# EAGLE design emrelabs-PanelDuino-2x8 (EAGLE 8.5.1)

## Sheet 1 of 2
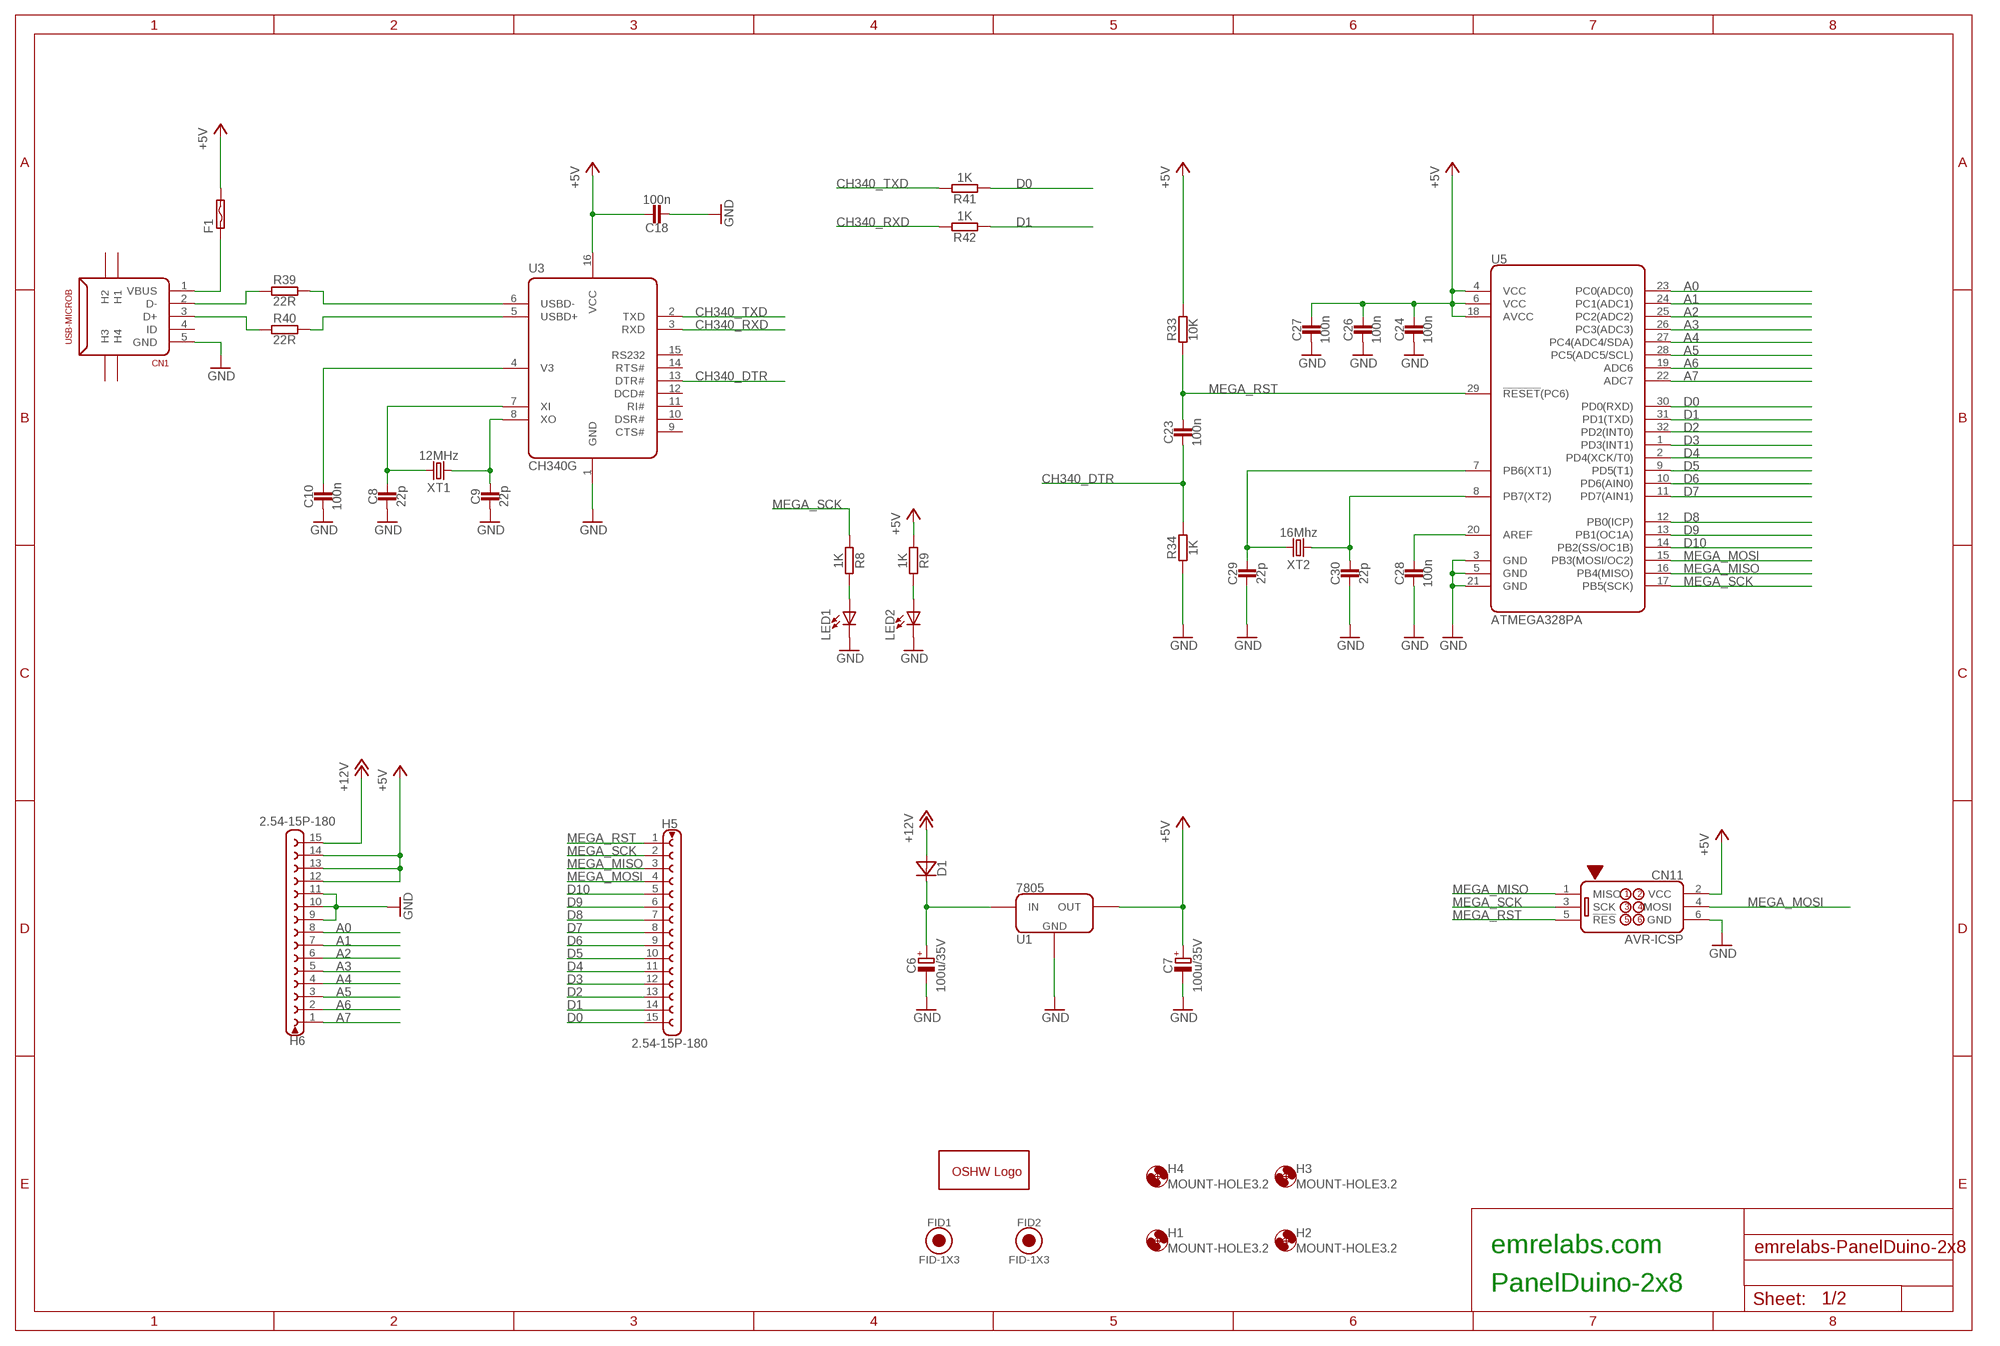
[diagram p0: schematic, sheet 1]

### Parts
C6  100u/35V  C-POL-SIZE-D-100U/35V  [ALU-SIZE-D]
C7  100u/35V  C-POL-SIZE-D-100U/35V  [ALU-SIZE-D]
C8  22p  C1206  [C1206]
C9  22p  C1206  [C1206]
C10  100n  C1206-100N  [C1206]
C18  100n  C1206-100N  [C1206]
C23  100n  C1206-100N  [C1206]
C24  100n  C1206-100N  [C1206]
C26  100n  C1206-100N  [C1206]
C27  100n  C1206-100N  [C1206]
C28  100n  C1206-100N  [C1206]
C29  22p  C1206  [C1206]
C30  22p  C1206  [C1206]
CN1  USB-MICROB  [USB-MICRO-B]
CN11  AVR-ICSP  [AVR-ICSP]
D1  D-DO214AC  [DO214AC]
F1  FUSE-PTC-1206  [F1206]
FID1  FID-1X3  FIDUCIAL1X3MM  [FIDUCIAL-1X3MM]
FID2  FID-1X3  FIDUCIAL1X3MM  [FIDUCIAL-1X3MM]
H1  MOUNT-HOLE3.2  [3,2]
H2  MOUNT-HOLE3.2  [3,2]
H3  MOUNT-HOLE3.2  [3,2]
H4  MOUNT-HOLE3.2  [3,2]
H5  2.54-15P-180  [2.54-15P]
H6  2.54-15P-180  [2.54-15P]
LED1  LED-1206  [LED1206]
LED2  LED-1206  [LED1206]
LOGO1  OSHWLOGOLOGO5MM  [OSHW_5MM]
R8  1K  R1206-1K  [R1206]
R9  1K  R1206-1K  [R1206]
R33  10K  R1206-10K  [R1206]
R34  1K  R1206-1K  [R1206]
R39  22R  R1206-22R  [R1206]
R40  22R  R1206-22R  [R1206]
R41  1K  R1206-1K  [R1206]
R42  1K  R1206-1K  [R1206]
U1  7805  7805-DPAK  [DPAK]
U3  CH340G  [SOIC-16]
U5  ATMEGA328PA  [TQFP32-6X6-P0.8]
XT1  12MHz  XT-2PIN-HC49  [XT-HC49]
XT2  16Mhz  XT-2PIN-HC49  [XT-HC49]

### Nets
+5V: C7.+ C18.1 C24.1 C26.1 C27.1 CN11.2(VCC) F1.2 H6.12 H6.13 H6.14 R9.1 R33.2 U1.3(OUT) U3.16(VCC) U5.4(VCC) U5.6(VCC) U5.18(AVCC) ; also sheet 2
+12V: D1.A H6.15
A0: H6.8 U5.23(PC0(ADC0))
A1: H6.7 U5.24(PC1(ADC1))
A2: H6.6 U5.25(PC2(ADC2))
A3: H6.5 U5.26(PC3(ADC3))
A4: H6.4 U5.27(PC4(ADC4/SDA)) ; also sheet 2
A5: H6.3 U5.28(PC5(ADC5/SCL)) ; also sheet 2
A6: H6.2 U5.19(ADC6)
A7: H6.1 U5.22(ADC7)
CH340_DTR: C23.2 R34.2 U3.13(DTR#)
CH340_RXD: R42.2 U3.3(RXD)
CH340_TXD: R41.2 U3.2(TXD)
D0: H5.15 R41.1 U5.30(PD0(RXD))
D1: H5.14 R42.1 U5.31(PD1(TXD))
D2: H5.13 U5.32(PD2(INT0))
D3: H5.12 U5.1(PD3(INT1))
D4: H5.11 U5.2(PD4(XCK/T0))
D5: H5.10 U5.9(PD5(T1))
D6: H5.9 U5.10(PD6(AIN0))
D7: H5.8 U5.11(PD7(AIN1))
D8: H5.7 U5.12(PB0(ICP))
D9: H5.6 U5.13(PB1(OC1A))
D10: H5.5 U5.14(PB2(SS/OC1B))
GND: C6.- C7.- C8.2 C9.2 C10.2 C18.2 C24.2 C26.2 C27.2 C28.2 C29.2 C30.2 CN1.5(GND) CN11.6(GND) H6.9 H6.10 H6.11 LED1.C LED2.C R34.1 U1.4(GND) U3.1(GND) U5.3(GND) U5.5(GND) U5.21(GND) ; also sheet 2
MEGA_MISO: CN11.1(MISO) H5.3 U5.16(PB4(MISO))
MEGA_MOSI: CN11.4(MOSI) H5.4 U5.15(PB3(MOSI/OC2))
MEGA_RST: C23.1 CN11.5(!RES!) H5.1 R33.1 U5.29(!RESET!(PC6))
MEGA_SCK: CN11.3(SCK) H5.2 R8.1 U5.17(PB5(SCK))
N$1: C6.+ D1.C U1.1(IN)
N$2: C10.1 U3.4(V3)
N$3: LED1.A R8.2
N$4: LED2.A R9.2
N$8: CN1.1(VBUS) F1.1
N$34: C28.1 U5.20(AREF)
N$38: C30.1 U5.8(PB7(XT2)) XT2.1
N$39: C9.1 U3.8(XO) XT1.1
N$40: C8.1 U3.7(XI) XT1.2
N$44: C29.1 U5.7(PB6(XT1)) XT2.2
N$88: CN1.2(D-) R39.1
N$89: CN1.3(D+) R40.1
N$90: R39.2 U3.6(USBD-)
N$91: R40.2 U3.5(USBD+)
Unconnected: CN1.4(ID) CN1.SH1(H1) CN1.SH2(H1) CN1.SH3(H4) CN1.SH4(H4) CN1.SH11(H1) CN1.SH21(H2) CN1.SH31(H3) CN1.SH41(H4) U3.9(CTS#) U3.10(DSR#) U3.11(RI#) U3.12(DCD#) U3.14(RTS#) U3.15(RS232)

### Notes on the sheet
- emrelabs.com
- PanelDuino-2x8

## Sheet 2 of 2
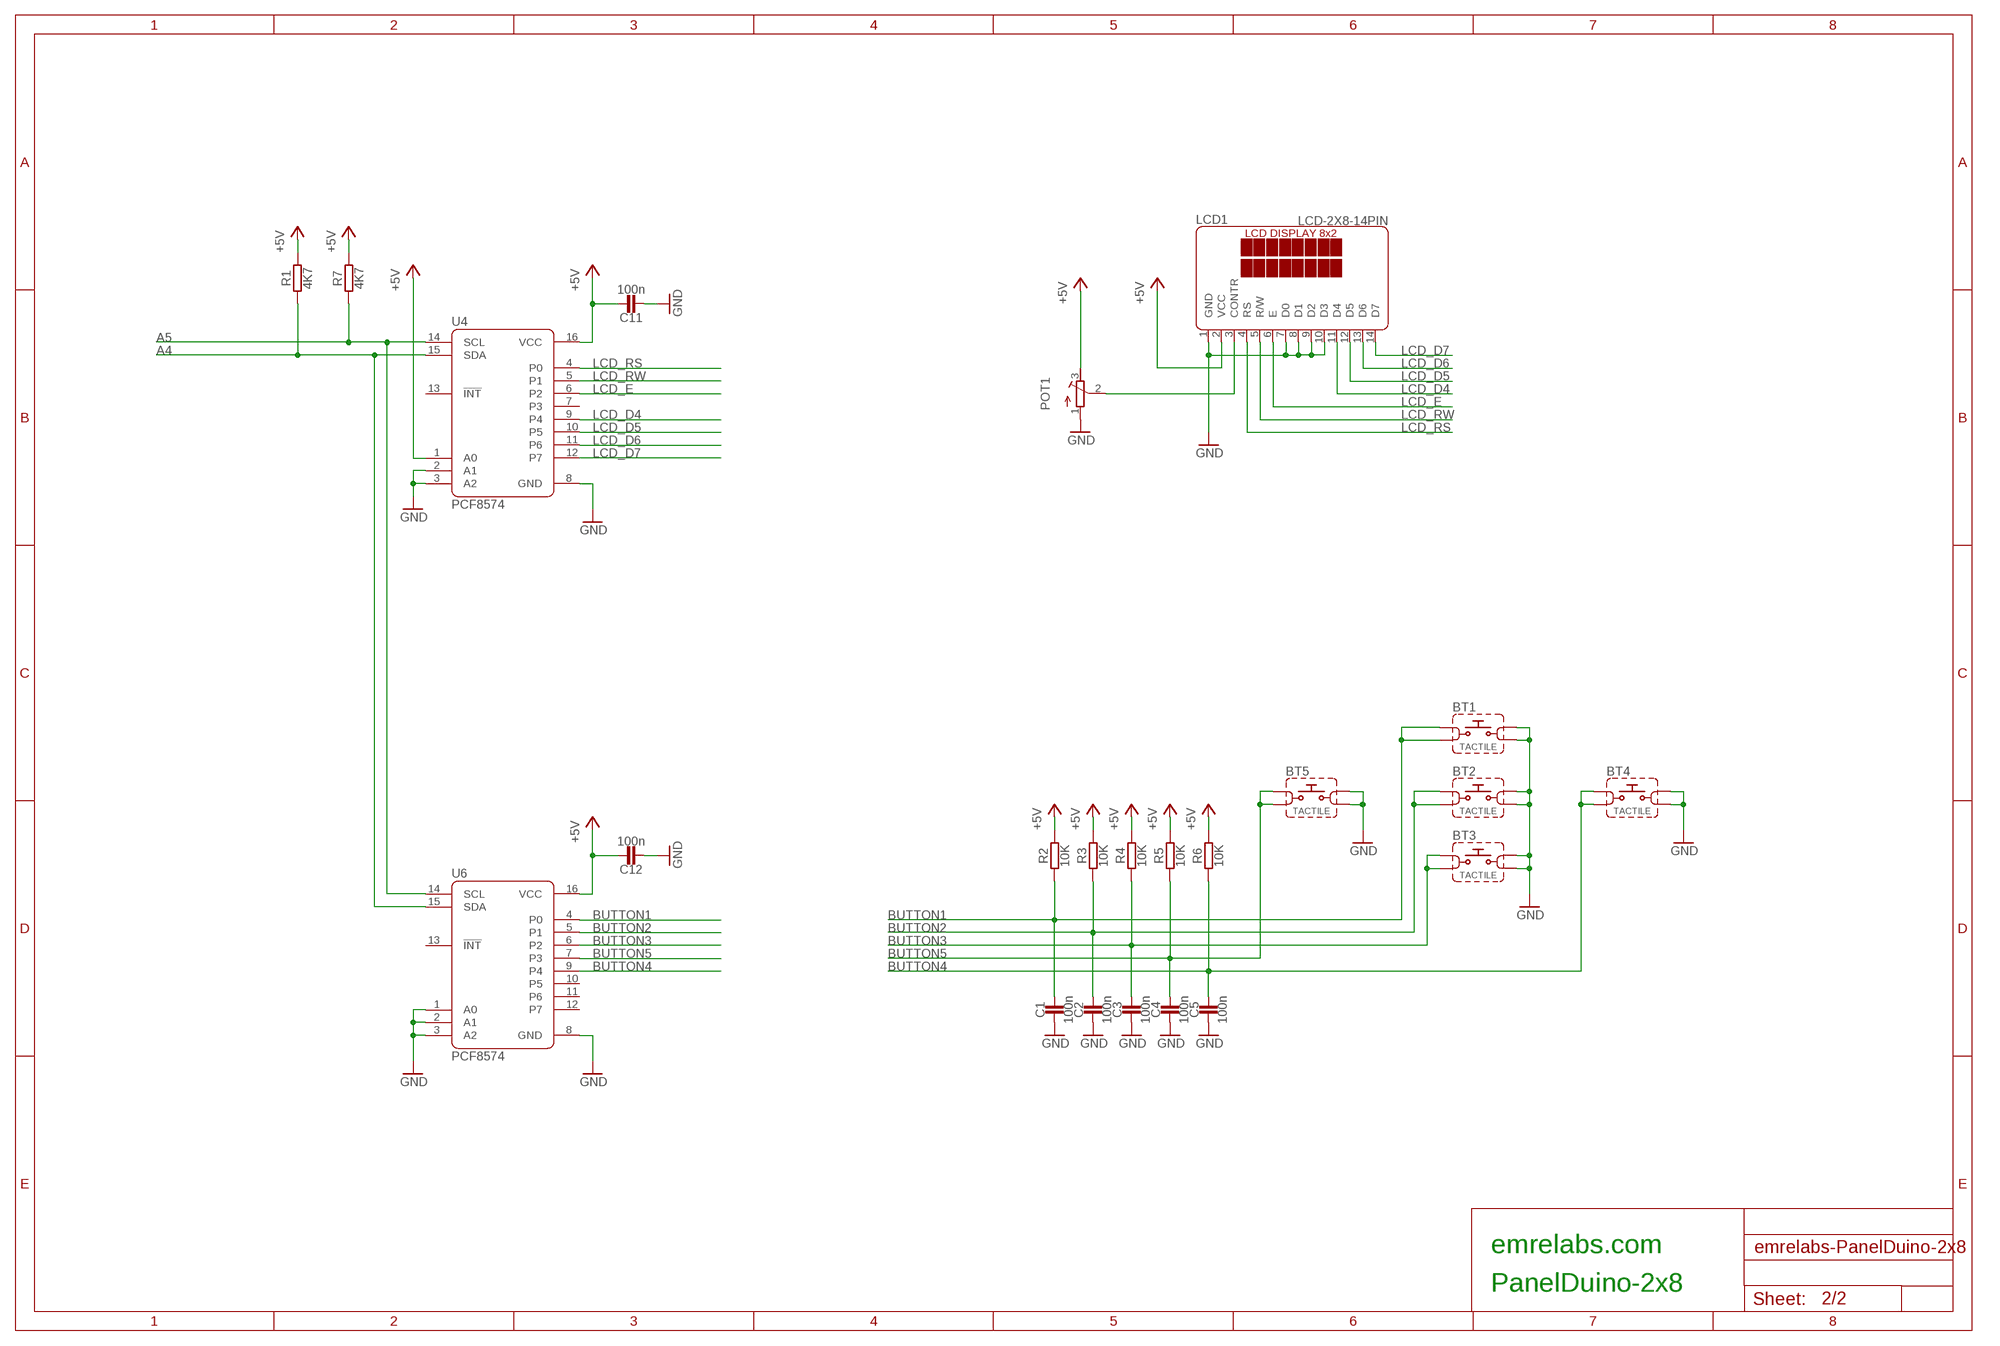
[diagram p1: schematic, sheet 2]

### Parts
BT1  TACTILE  TACTILE-4PIN-6X6MM-DIP  [TACTILE-6X6-DIP]
BT2  TACTILE  TACTILE-4PIN-6X6MM-DIP  [TACTILE-6X6-DIP]
BT3  TACTILE  TACTILE-4PIN-6X6MM-DIP  [TACTILE-6X6-DIP]
BT4  TACTILE  TACTILE-4PIN-6X6MM-DIP  [TACTILE-6X6-DIP]
BT5  TACTILE  TACTILE-4PIN-6X6MM-DIP  [TACTILE-6X6-DIP]
C1  100n  C1206-100N  [C1206]
C2  100n  C1206-100N  [C1206]
C3  100n  C1206-100N  [C1206]
C4  100n  C1206-100N  [C1206]
C5  100n  C1206-100N  [C1206]
C11  100n  C1206-100N  [C1206]
C12  100n  C1206-100N  [C1206]
LCD1  LCD-2X8-14PIN  [2X8-LCD-14PIN]
POT1  R-TRIM-5X4.5MM  [R-TRIM-5X4.5MM]
R1  4K7  R1206-4K7  [R1206]
R2  10K  R1206-10K  [R1206]
R3  10K  R1206-10K  [R1206]
R4  10K  R1206-10K  [R1206]
R5  10K  R1206-10K  [R1206]
R6  10K  R1206-10K  [R1206]
R7  4K7  R1206-4K7  [R1206]
U4  PCF8574  PCF8574-SOIC16W  [SOIC-16W]
U6  PCF8574  PCF8574-SOIC16W  [SOIC-16W]

### Nets
+5V: C11.1 C12.1 LCD1.2(VCC) POT1.3(E) R1.2 R2.2 R3.2 R4.2 R5.2 R6.2 R7.2 U4.1(A0) U4.16(VCC) U6.16(VCC) ; also sheet 1
A4: R1.1 U4.15(SDA) U6.15(SDA) ; also sheet 1
A5: R7.1 U4.14(SCL) U6.14(SCL) ; also sheet 1
BUTTON1: BT1.1A BT1.1B C1.1 R2.1 U6.4(P0)
BUTTON2: BT2.1A BT2.1B C2.1 R3.1 U6.5(P1)
BUTTON3: BT3.1A BT3.1B C3.1 R4.1 U6.6(P2)
BUTTON4: BT4.1A BT4.1B C5.1 R6.1 U6.9(P4)
BUTTON5: BT5.1A BT5.1B C4.1 R5.1 U6.7(P3)
GND: BT1.2A BT1.2B BT2.2A BT2.2B BT3.2A BT3.2B BT4.2A BT4.2B BT5.2A BT5.2B C1.2 C2.2 C3.2 C4.2 C5.2 C11.2 C12.2 LCD1.1(GND) LCD1.7(D0) LCD1.8(D1) LCD1.9(D2) LCD1.10(D3) POT1.1(A) U4.2(A1) U4.3(A2) U4.8(GND) U6.1(A0) U6.2(A1) U6.3(A2) U6.8(GND) ; also sheet 1
LCD_D4: LCD1.11(D4) U4.9(P4)
LCD_D5: LCD1.12(D5) U4.10(P5)
LCD_D6: LCD1.13(D6) U4.11(P6)
LCD_D7: LCD1.14(D7) U4.12(P7)
LCD_E: LCD1.6(E) U4.6(P2)
LCD_RS: LCD1.4(RS) U4.4(P0)
LCD_RW: LCD1.5(R/W) U4.5(P1)
N$7: LCD1.3(CONTR) POT1.2(S)
Unconnected: U4.7(P3) U4.13(!INT!) U6.10(P5) U6.11(P6) U6.12(P7) U6.13(!INT!)

### Notes on the sheet
- emrelabs.com
- PanelDuino-2x8

## Library data of the parts
BT1-BT5 = Elib-Connector:TACTILE-4PIN
C1-C5 C10-C12 C18 C23 C24 C26-C28 = Elib-RLC-D-XT:C?-*
C6 C7 = Elib-RLC-D-XT:C-POL-?-*
C8 C9 C29 C30 = Elib-RLC-D-XT:C
CN1 = Elib-Connector:USB-MICRO
CN11 = Elib-Mcu:AVR-ICSP
D1 = Elib-RLC-D-XT:D
F1 = Elib-RLC-D-XT:FUSE-PTC
FID1 FID2 = Elib-Misc:FIDUCIAL
H1-H4 = holes:MOUNT-HOLE: MOUNTING HOLE with drill center marker
H5 H6 = Elib-Connector:2.54-15P
LCD1 = Elib-Opto:LCD-2X8-14PIN
LED1 LED2 = Elib-RLC-D-XT:LED
LOGO1 = Elib-Misc:OSHWLOGO: The OSHW logo for PCB layout
POT1 = Elib-RLC-D-XT:R-TRIM
R1 R7 = Elib-RLC-D-XT:R?-*: Resistor SMD 5% 1/8W 0805; DIGIKEYPN: 311-4.7KERCT-ND; MANUFACTURER: Yageo
R2-R6 R33 = Elib-RLC-D-XT:R?-*: Resistor SMD 5% 1/8W 0805; DIGIKEYPN: 311-10KERCT-ND; MANUFACTURER: Yageo
R8 R9 R34 R41 R42 = Elib-RLC-D-XT:R?-*: Resistor SMD 5% 1/8W 0805; DIGIKEYPN: 311-1.0KERCT-ND; MANUFACTURER: Yageo
R39 R40 = Elib-RLC-D-XT:R?-*: Resistor SMD 5% 1/8W 0805; DIGIKEYPN: 311-22ERCT-ND; MANUFACTURER: Yageo
U1 = Elib-PowerMng:7805
U3 = Elib-IC-Generic:CH340G
U4 U6 = Elib-Logic:PCF8574: Remote 8-bit I/O expander for I2C-bus with interrupt
U5 = Elib-Mcu:ATMEGA328
XT1 XT2 = Elib-RLC-D-XT:XT-2PIN

## Board
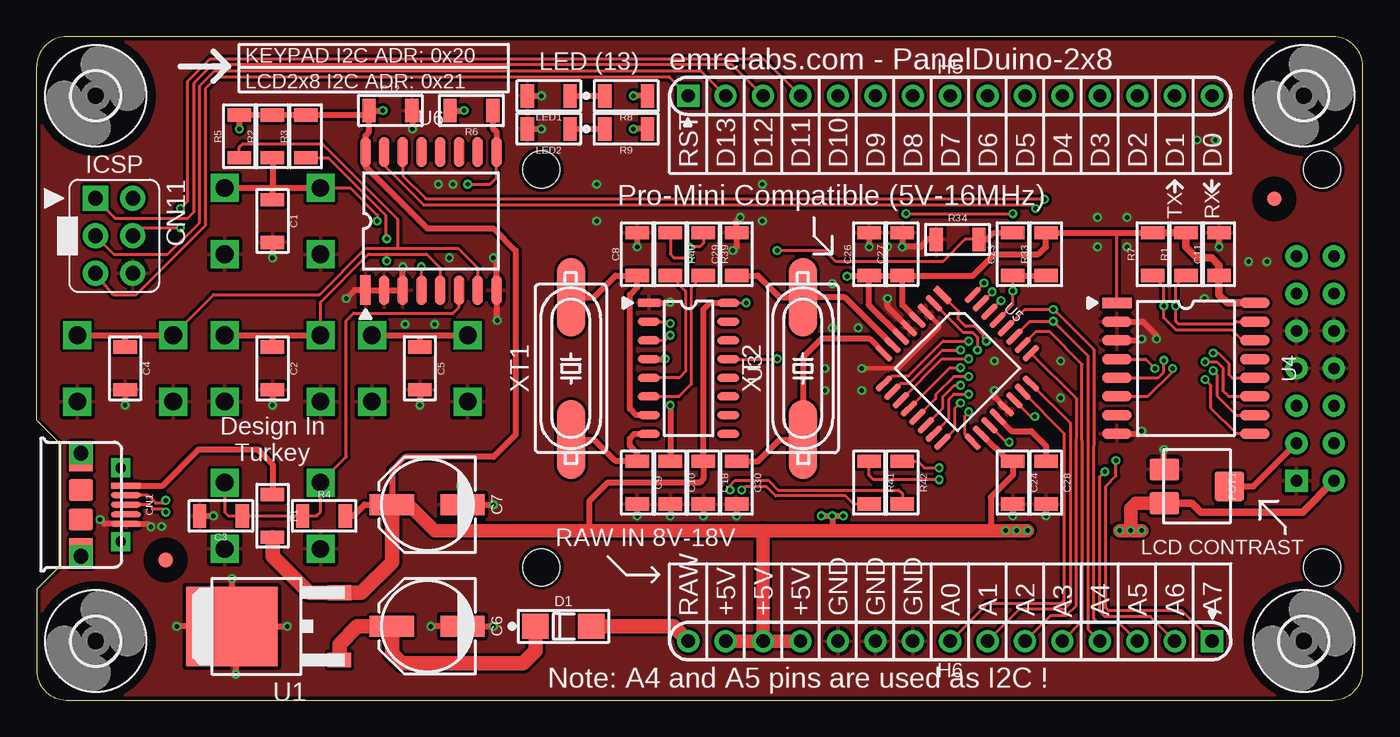
[diagram p2: board, top side]
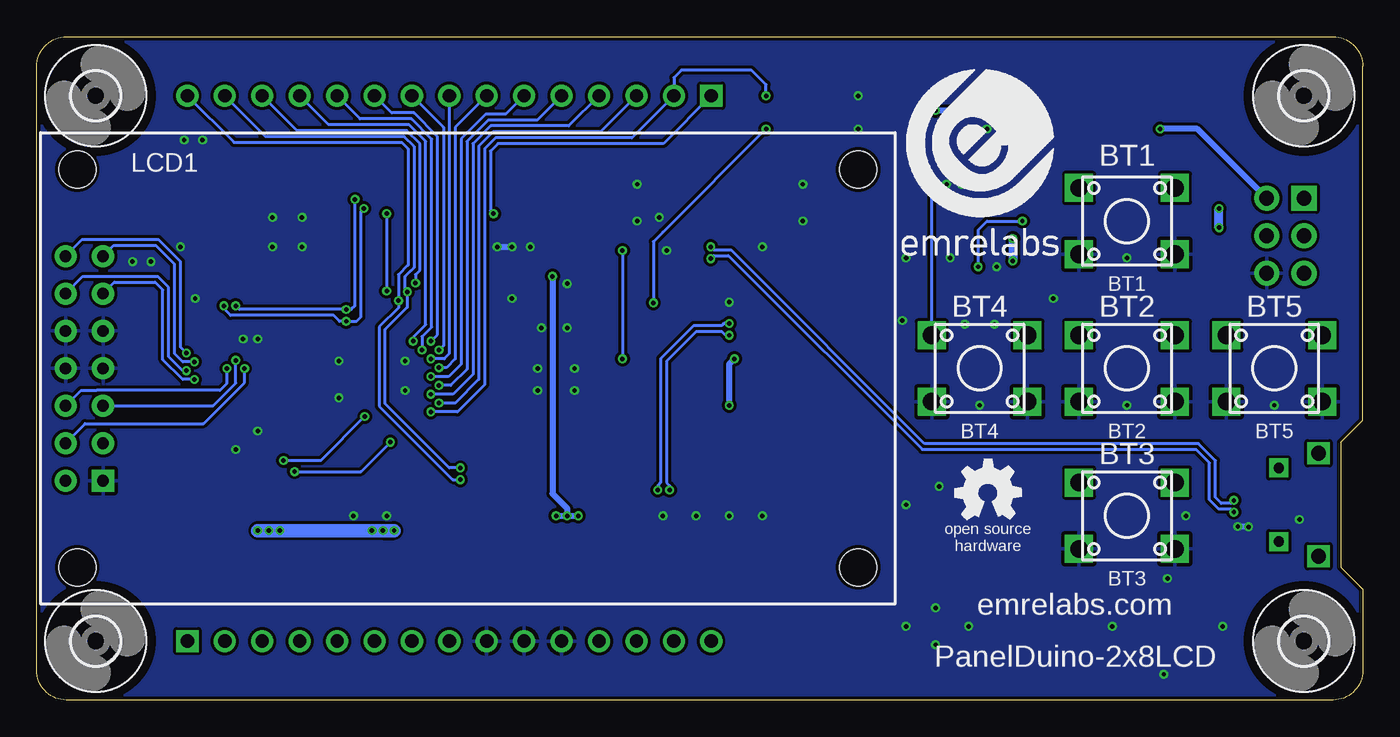
[diagram p3: board, bottom side, seen from below]

Size 90 x 45 mm. Coordinates in mm from the lower left corner, seen from the top.
Outline: 0,2 arc90 2,0 88,0 arc90 90,2 90,43 arc90 88,45 2,45 arc90 0,43 0,19 1.5,17.5 1.5,9 0,7.5 0,2
Copper layers (1*16): Top 0.035mm / dielectric 1.5mm / Bottom 0.035mm
Design rules "default *": minimum track width 0.15mm, minimum drill 0.3mm, track to track 0.2mm, track to pad 0.2mm, pad to pad 0.2mm, via to via 0.2mm, smd to smd 0.05mm, copper to edge 0.25mm, drill to drill 0.15mm, minimum pad ring 10mil, minimum via ring 0.15mm, stop-mask expansion 3mil, vias tented up to drill 0.4mm, thermal gap 10mil

### Footprints (pad centres in the part's own frame; a part is rotated, then mirrored left to right if it is on the bottom)
TACTILE-6X6-DIP = drill 1.2 pad 1.9 square: 1A -3.25,-2.25; 1B 3.25,-2.25; 2A 3.25,2.25; 2B -3.25,2.25
C1206 = smd 0.9 x 1.6: 1 -1.45,0; 2 1.45,0
ALU-SIZE-D = smd 3 x 1.4: + 2.4,0; - -2.4,0
USB-MICRO-B = smd 0.4 x 2: 1 -1.3,3.05; 2 -0.65,3.05; 3 0,3.05; 4 0.65,3.05; 5 1.3,3.05 | smd 2 x 1.6: SH1 -3.272,0; SH4 3.272,0 | smd 1.5 x 1.6: SH2 -1,0; SH3 1,0 | drill 1 pad 1.5 square: SH11 -3.5,0; SH41 3.5,0 | drill 0.7 pad 1.3 square: SH21 -2.5,2.7; SH31 2.5,2.7
AVR-ICSP = drill 1 pad 1.7 square: 1 -2.54,-1.27 | drill 1 pad 1.7: 2 -2.54,1.27; 3 0,-1.27; 4 0,1.27; 5 2.54,-1.27; 6 2.54,1.27
DO214AC = smd 1.8 x 1.7: A 1.9,0; C -1.9,0
F1206 = smd 0.9 x 1.6: 1 -1.45,0; 2 1.45,0
FIDUCIAL-1X3MM = smd 1 x 1: FID 0,0
3,2 = hole 3.2: 0,0
2.54-15P = drill 0.9 pad 1.5 square: 1 -17.78,0 | drill 0.9 pad 1.5: 2 -15.24,0; 3 -12.7,0; 4 -10.16,0; 5 -7.62,0; 6 -5.08,0; 7 -2.54,0; 8 0,0; 9 2.54,0; 10 5.08,0; 11 7.62,0; 12 10.16,0; 13 12.7,0; 14 15.24,0; 15 17.78,0
2X8-LCD-14PIN = drill 0.8 pad 1.5 square: 1 -24.76,-7.62 | drill 0.8 pad 1.5: 2 -27.3,-7.62; 3 -24.76,-5.08; 4 -27.3,-5.08; 5 -24.76,-2.54; 6 -27.3,-2.54; 7 -24.76,0; 8 -27.3,0; 9 -24.76,2.54; 10 -27.3,2.54; 11 -24.76,5.08; 12 -27.3,5.08; 13 -24.76,7.62; 14 -27.3,7.62 | hole 2.5: -26.5,-13.5; 26.5,-13.5; -26.5,13.5; 26.5,13.5
LED1206 = smd 0.9 x 1.6: A -1.45,0; C 1.45,0
R-TRIM-5X4.5MM = smd 1.5 x 2: 1 -1.15,-2.2; 3 1.15,-2.2 | smd 2 x 2: 2 0,2.2
R1206 = smd 0.9 x 1.6: 1 -1.45,0; 2 1.45,0
DPAK = smd 1 x 1.6: 1 -2.28,-4.8; 3 2.28,-4.8 | smd 5.4 x 6.2: 4 0,2.5
SOIC-16 = smd 0.55 x 1.5: 1 -4.445,-2.7; 2 -3.175,-2.7; 3 -1.905,-2.7; 4 -0.635,-2.7; 5 0.635,-2.7; 6 1.905,-2.7; 7 3.175,-2.7; 8 4.445,-2.7; 9 4.445,2.7; 10 3.175,2.7; 11 1.905,2.7; 12 0.635,2.7; 13 -0.635,2.7; 14 -1.905,2.7; 15 -3.175,2.7; 16 -4.445,2.7
SOIC-16W = smd 0.7 x 2: 1 -4.445,-4.685; 2 -3.175,-4.685; 3 -1.905,-4.685; 4 -0.635,-4.685; 5 0.635,-4.685; 6 1.905,-4.685; 7 3.175,-4.685; 8 4.445,-4.685; 9 4.445,4.685; 10 3.175,4.685; 11 1.905,4.685; 12 0.635,4.685; 13 -0.635,4.685; 14 -1.905,4.685; 15 -3.175,4.685; 16 -4.445,4.685
TQFP32-6X6-P0.8 = smd 1.4 x 0.45: 1 -4.25,2.8; 2 -4.25,2; 3 -4.25,1.2; 4 -4.25,0.4; 5 -4.25,-0.4; 6 -4.25,-1.2; 7 -4.25,-2; 8 -4.25,-2.8; 17 4.25,-2.8; 18 4.25,-2; 19 4.25,-1.2; 20 4.25,-0.4; 21 4.25,0.4; 22 4.25,1.2; 23 4.25,2; 24 4.25,2.8 | smd 0.45 x 1.4: 9 -2.8,-4.25; 10 -2,-4.25; 11 -1.2,-4.25; 12 -0.4,-4.25; 13 0.4,-4.25; 14 1.2,-4.25; 15 2,-4.25; 16 2.8,-4.25; 25 2.8,4.25; 26 2,4.25; 27 1.2,4.25; 28 0.4,4.25; 29 -0.4,4.25; 30 -1.2,4.25; 31 -2,4.25; 32 -2.8,4.25
XT-HC49 = smd 5.334 x 1.93: 1 -4.826,0; 2 4.826,0

### Placement (x,y rotation side)
BT1  16,32.5 180 bottom
BT2  16,22.5 180 bottom
BT3  16,12.5 180 bottom
BT4  26,22.5 180 bottom
BT5  6,22.5 180 bottom
C1  16,32.5 270 top
C2  16,22.5 270 top
C3  12.5,12.5 180 top
C4  6,22.5 270 top
C5  26,22.5 270 top
C6  26.5,5 180 top
C7  26.5,13.25 180 top
C8  40.75,30.25 90 top
C9  40.75,14.75 270 top
C10  43,14.75 270 top
C11  80.25,30.25 90 top
C12  24,40 0 top
C18  45.25,14.75 270 top
C23  66.25,30.25 90 top
C24  66.25,14.75 270 top
C26  56.5,30.25 90 top
C27  58.75,30.25 90 top
C28  68.5,14.75 270 top
C29  47.5,30.25 90 top
C30  47.5,14.75 270 top
CN1  3,13.25 270 top
CN11  5.25,31.5 270 top
D1  35.75,5 0 top
F1  16,12.5 270 top
FID1  8.75,9.5 0 top
FID2  84,34 0 top
H1  4,4 0 top
H2  86,4 0 top
H3  86,41 0 top
H4  4,41 0 top
H5  62,41 0 top
H6  62,4 180 top
LCD1  60.75,22.5 0 bottom
LED1  34.75,41 180 top
LED2  34.75,38.75 180 top
LOGO1  25.44,14.05 0 bottom
POT1  78.75,14.5 270 top
R1  78,30.25 90 top
R2  16,38.25 90 top
R3  18.25,38.25 90 top
R4  19.5,12.5 0 top
R5  13.75,38.25 90 top
R6  29.5,40 180 top
R7  75.75,30.25 90 top
R8  40,41 180 top
R9  40,38.75 180 top
R33  68.5,30.25 90 top
R34  62.5,31.25 0 top
R39  45.25,30.25 270 top
R40  43,30.25 270 top
R41  56.5,14.75 270 top
R42  58.75,14.75 270 top
U1  15.75,5 90 top
U3  44.25,22.5 270 top
U4  78,22.5 270 top
U5  62.5,22.5 315 top
U6  26.75,32.5 0 top
XT1  36.25,22.5 90 top
XT2  52,22.5 90 top

### Tracks (layer width: path | path; a pad name or v marks a point on that pad's centre or on a via)
+5V  (via drill 0.3 pad 0.6)
  Top 0.2: U4.1 73.31,31.64 73.25,31.7 | U3.16 v48.15,26.95
  Top 0.4: U3.16 45.7,26.95 45.25,26.5 C18.1 45.25,15 45,14.75 38.75,14.75 37.5,13.5 37.5,11.5 | U5.4 58.75,26.82 C27.1 | U5.6 56.5,26.8 C26.1 | C26.1 C27.1 | U5.18 65.97,16.2 C24.1 66.25,15.25 64.75,13.75 64.75,11.5 | R4.2 21.5,12.5 22.25,13.25 C7.+ 24.1,15.6 25,16.5 31,16.5 32.5,18 32.5,30.5 31,32 26.5,32 22.3,36.2 U6.16 22.3,38.3 22.55,38.55 C12.1 | C12.1 v23.5,40 | R6.2 v29,40 | R7.2 73.25,31.7 R33.2 68.5,30.75 68,30.25 65,30.25 63.55,28.8 C27.1 | C26.1 56.45,28.75 v55,28.75 | C12.1 22.25,39.7 R3.2 R2.2 R5.2 v13.75,38.75 | v54,12.5 v54.75,12.5 | v53.25,12.5 v54,12.5 | v54,12.5 54,11.5 | R9.1 v40.5,38.75
  Top 0.5: U4.16 80.81,26.95 80.25,27.5 C11.1 80.25,29.5 79.75,30 78.75,30 78,30.75 R1.2 R7.2 | POT1.3 78.4,13.35 79,12.75 85.92,12.75 LCD1.2
  Top 0.9: C7.+ 25.25,13.25 27,11.5 37.5,11.5 49.25,11.5 | H6.14 H6.13 | H6.12 H6.13 | 49.25,11.5 54,11.5 64.75,11.5 v65.75,11.5 v66.5,11.5 v67.25,11.5 | v73.5,11.5 v74.25,11.5 | v74.25,11.5 v75,11.5 | v74.25,11.5 74.25,13 74.6,13.35 POT1.3 | H6.13 49.3,11.45 49.25,11.5
  Top 1: C7.+ 24.1,9.35 22.03,7.28 U1.3 18.47,7.28 16,9.75 F1.2
  Bottom 0.2: v48.15,26.95 48.15,31.1 47.5,31.75 v40.5,38.75
  Bottom 0.4: v23.5,40 25.5,40 25.75,40 v29,40 | CN11.2 11.23,38.75 v13.75,38.75 | v54,12.5 54,13 55,14 v55,28.75 | v54,12.5 v53.25,12.5 | v54.75,12.5 v54,12.5
  Bottom 0.9: v75,11.5 v74.25,11.5 v73.5,11.5 v67.25,11.5 v66.5,11.5 v65.75,11.5
+12V
  Top 1: H6.15 43.22,5 D1.A
A0
  Top 0.2: U5.23 69.66,18.16 69.75,18.08 69.75,6.75 69.56,6.56 64.56,6.56 H6.8
A1
  Top 0.2: 70.15,17.91 | U5.24 70.15,18.81 70.15,17.91 | H6.7 66.7,6.16 69.74,6.16 70.15,6.57 70.15,17.91
A2
  Top 0.2: 70.55,17.75 | U5.25 70.55,20.46 70.55,17.75 | H6.6 68.83,5.75 69.9,5.75 70.55,6.4 70.55,17.75
A3
  Top 0.2: U5.26 67.83,25 68.75,25 70.95,22.8 70.95,17.58 | 70.95,17.58 | H6.5 70.95,5.33 70.95,17.58
A4  (via drill 0.3 pad 0.6)
  Top 0.2: 71.35,17.42 | H6.4 71.35,4.81 71.35,17.42 | U5.27 67.4,25.7 v69,25.7 71.35,23.35 71.35,17.42 | U6.15 23.57,36.27 26.25,33.6 67.55,33.6 v67.8,33.35 | R1.1 77.3,28.1 v77.3,26.75 77.3,25.7 77.5,25.5 81.25,25.5 81.42,25.68 U4.15
  Bottom 0.2: v67.8,33.35 68,33.15 68,26 68.3,25.7 v69,25.7 69.45,25.7 69.85,26.1 76.85,26.1 77.3,26.55 v77.3,26.75
A5  (via drill 0.3 pad 0.6)
  Top 0.2: 71.75,17.25 71.75,23.8 69.25,26.3 69.2,26.3 v69,26.5 67.07,26.5 U5.28 | 71.75,17.25 | H6.3 73.45,5.25 72,5.25 71.75,5.5 71.75,17.25 | U6.14 24.84,35.57 26.42,34 68.37,34 v68.4,33.97 | R7.1 76.5,28.05 v76.5,26.75 76.5,25.93 77.33,25.1 81.15,25.1 81.84,24.41 U4.14
  Bottom 0.2: v68.4,33.97 68.4,26.75 68.65,26.5 v69,26.5 76.25,26.5 v76.5,26.75
A6  (via drill 0.3 pad 0.6)
  Top 0.2: H6.2 75.59,5.65 72.5,5.65 72.15,6 72.15,15.15 v72.5,15.5 | U5.19 65.8,17.5 v66,17.5
  Bottom 0.2: v72.5,15.5 68,15.5 v66,17.5
A7  (via drill 0.3 pad 0.6)
  Top 0.2: H6.1 77.73,6.05 72.75,6.05 72.55,6.25 72.55,14.5 73.25,15.2 v73.25,16.25 | U5.22 67.46,19.24 v67.74,19.24
  Bottom 0.2: v67.74,19.24 70.73,16.25 v73.25,16.25
BUTTON1  (via drill 0.3 pad 0.6)
  Top 0.2: U6.4 26.11,29.39 v26.1,29.4 | BT1.1B 21.25,34.75 23.1,32.9 v23.1,32.5
  Top 0.4: BT1.1A 16,34.75 | 16,34.75 BT1.1B | C1.1 16,34.75 | R2.1 16,34.75
  Bottom 0.2: v26.1,29.4 26.1,31.9 25.5,32.5 v23.1,32.5
BUTTON2  (via drill 0.3 pad 0.6)
  Top 0.2: U6.5 27.39,29.32 26.45,30.25 23.75,30.25 | R3.1 19.77,36.8 23.7,32.87 23.7,31.35 v23.75,31.3 | BT2.1B 19.25,27 22.5,30.25 23.75,30.25 | v23.75,29.8 23.75,30.25
  Top 0.4: BT2.1A 16,24.75 | 16,24.75 BT2.1B | C2.1 16,24.75
  Bottom 0.6: v23.75,31.3 v23.75,29.8
BUTTON3
  Top 0.2: 28.66,28 U6.6 28.66,26.66 28.25,26.25 21.5,26.25 21,25.75 21,16.5 BT3.1B 19.25,12.75 19,12.5 R4.1 C3.1 13,12.5 12.75,12.75 BT3.1A
BUTTON4  (via drill 0.3 pad 0.6)
  Top 0.2: v29.25,35 30.75,35 31.2,35.45 U6.9
  Top 0.4: BT4.1A 26,24.75 | 26,24.75 BT4.1B | C5.1 26,24.75 | R6.1 30.95,38.8 31.2,38.55 U6.9
  Bottom 0.2: BT4.1B v29.25,35
BUTTON5
  Top 0.2: U6.7 29.93,29.32 28.6,30.65 24.5,30.65 | R5.1 13.75,37.5 14,37.75 19.38,37.75 24.5,32.63 24.5,30.65 | BT5.1B 12,27.5 19.18,27.5 22.33,30.65 24.5,30.65
  Top 0.4: BT5.1A 6,24.75 | 6,24.75 BT5.1B | C4.1 6,24.75
CH340_DTR  (via drill 0.3 pad 0.6)
  Top 0.2: R34.2 63,31.25 61.5,29.75 54.25,29.75 53.5,30.5 v50.25,30.5 | U3.13 50.23,23.14 v50.25,23.15
  Top 0.4: R34.2 64.5,31.25 64.95,31.7 C23.2
  Bottom 0.2: v50.25,30.5 v50.25,23.15
CH340_RXD  (via drill 0.3 pad 0.6)
  Top 0.2: U3.3 42.66,24.41 v43,24.75 | v47.05,14.25 47.05,14.55 47.4,14.9 49.67,14.9 50.32,14.25 58.5,14.25 58.75,14 R42.2
  Bottom 0.2: v43,24.75 43.25,24.75 43.5,25 45.25,25 47.25,23 47.25,14.75 47.05,14.55 v47.05,14.25
CH340_TXD  (via drill 0.3 pad 0.6)
  Top 0.2: U3.2 42.88,25.68 v43,25.55 | v47.85,14.25 48.1,14.5 49.5,14.5 50.15,13.85 54.9,13.85 55.45,13.3 R41.2
  Bottom 0.2: v43,25.55 43.35,25.55 43.5,25.4 45.42,25.4 47.65,23.17 47.65,14.75 47.85,14.55 v47.85,14.25
D0  (via drill 0.3 pad 0.6)
  Top 0.2: U5.30 65.4,27.1 v65.45,27.1 | v61.25,14.95 56.8,14.95 56.5,15.25 R41.1
  Bottom 0.2: H5.15 76.61,37.84 65.23,37.84 64.8,37.41 64.8,29.5 64.82,29.5 65.45,28.87 v65.45,27.1 65.45,26.62 66.75,25.32 66.75,19.93 61.77,14.95 v61.25,14.95
D1  (via drill 0.3 pad 0.6)
  Top 0.2: U5.31 64.85,27.68 v64.85,27.7 | R42.1 59.8,16.2 60.25,15.75 v61.25,15.75
  Bottom 0.2: H5.14 74.47,38.23 65.06,38.23 64.4,37.57 64.4,29.33 64.63,29.1 64.65,29.1 65,28.75 65,27.85 v64.85,27.7 64.85,26.65 66.35,25.15 66.35,20.1 62,15.75 v61.25,15.75 61.43,15.75
D2  (via drill 0.3 pad 0.6)
  Top 0.2: U5.32 64.3,28.26 v64.3,28.3
  Bottom 0.2: H5.13 72.33,38.63 64.9,38.63 64,37.74 64,29.17 64.3,28.87 v64.3,28.3
D3  (via drill 0.3 pad 0.6)
  Top 0.2: v64.45,24.35 64.25,24.55 64.25,24.76 63.66,25.35 63.04,25.35 62.57,25.82 62.57,26.39 U5.1
  Bottom 0.2: H5.12 70.19,39.03 64.73,39.03 63.6,37.9 63.6,25.47 64.45,24.62 v64.45,24.35
D4  (via drill 0.3 pad 0.6)
  Top 0.2: U5.2 62.88,24.95 63.5,24.95 63.85,24.6 v63.85,23.75
  Bottom 0.2: H5.11 68.06,39.44 64.57,39.44 63.2,38.07 63.2,25.3 63.85,24.65 v63.85,23.75
D5  (via drill 0.3 pad 0.6)
  Top 0.2: v63.25,24.35 61.52,24.35 59.17,22 58.04,22 U5.9
  Bottom 0.2: H5.10 65.92,39.84 64.4,39.84 62.8,38.23 62.8,24.8 v63.25,24.35
D6  (via drill 0.3 pad 0.6)
  Top 0.2: v62.7,23.75 61.49,23.75 59.24,21.5 58.67,21.5 U5.10
  Bottom 0.2: H5.9 62.4,38.86 62.4,24.05 v62.7,23.75
D7  (via drill 0.3 pad 0.6)
  Top 0.2: U5.11 61.45,23.15 v63.25,23.15
  Bottom 0.2: v63.25,23.15 62.35,23.15 62,23.5 H5.8
D8  (via drill 0.3 pad 0.6)
  Top 0.2: U5.12 61.98,22.55 v62.7,22.55
  Bottom 0.2: H5.7 61.6,38.86 61.6,23.15 62.2,22.55 v62.7,22.55
D9  (via drill 0.3 pad 0.6)
  Top 0.2: U5.13 61,20.43 61,20.7 62.25,21.95 v63.25,21.95
  Bottom 0.2: H5.6 58.17,39.75 59.53,39.75 61.2,38.08 61.2,22.8 62.05,21.95 v63.25,21.95
D10  (via drill 0.3 pad 0.6)
  Top 0.2: U5.14 61.5,19.8 61.5,20.57 61.72,20.78 61.84,20.91 62.28,21.35 v62.7,21.35
  Bottom 0.2: H5.5 56.03,39.35 59.36,39.35 60.8,37.91 60.8,22.45 61.9,21.35 v62.7,21.35
GND  (via drill 0.3 pad 0.6)
  Top 0.3: U5.3 61.25,25.45 61.25,25.25 58.5,22.5 v56,22.5
  Top 0.4: C3.2 v12,12.5 | U1.4 v9.5,5 | U1.4 v17,5 | U1.4 v13.25,8.25 | U1.4 13.5,4.75 v13.5,1.75 | C6.- 29,5.1 v29,6.25 | C6.- 29,4.9 v29,3.75 | C6.- v26.75,5 | C6.- v31,5 | v28.75,14.5 28.75,13.4 C7.- v31,13.25 | C9.2 v40.75,12.5 | C10.2 v43,12.5 | C18.2 v45.25,12.5 | C30.2 v47.5,12.5 | C24.2 v66.25,12.5 | C28.2 v68.5,12.5 | U4.8 74.81,18.05 v75,18.25 | POT1.1 76.5,15.7 v76.5,17 | U4.2 75.08,25.68 76,24.75 v76,24.5 | U4.3 74.91,24.41 v75,24.5 | C11.2 v80.25,30.75 | C26.2 v56.5,30.75 | C27.2 v58.75,30.75 60,30.75 60.5,31.25 R34.1 | U5.5 57.75,26.68 v57.75,27.25 | U5.21 65,20.57 v65,21 | U3.1 42.95,26.95 v43,27 | v47.25,30.5 47.5,30.75 C29.2 47.5,32.5 v47.75,32.75 | C8.2 v40.75,30.75 | LED2.C v34.25,38.75 | LED1.C v34.25,41 | C12.2 25.5,39.95 v25.5,38.75 | C1.2 v16,30 | C2.2 v16,20 | C5.2 v26,20 | C4.2 v6,20 | v21,27.25 21.57,27.82 U6.1 U6.2 U6.3 v24.84,29.39 v24.85,29.4 | v31,30 31.2,29.8 U6.8 31.2,25.8 v31.25,25.75 | v4.3,12.25 4.6,11.95 CN1.5 7.55,11.95 v7.75,11.75
  Bottom 0.4: v58.75,30.75 v57.75,30.75 | v7.75,11.75 8.45,11.75 v8.48,11.77
  other vias: 53.5,21 56,21 38,32.5 38,35 49.25,35 49.25,32.5 28.25,35 27.25,35 25,25.5 27,25.5 54,25.25 54,28.25 55.75,25.25 53.5,22.5 69.5,23 69.5,20.5 65,23 79.25,27.25 83.5,29.75 82.25,29.75 78.75,38 80,38 28,30 72,30.75 74,30.75 74,32.75 72,32.75
  pour Bottom (rank 6): 0,0 0,45 11,45 90,45 90,31 90,0
  pour Top (rank 6): 0,0 0,45 90,45 90,0
LCD_D4  (via drill 0.3 pad 0.6)
  Top 0.2: U4.9 81.44,18.05 79.7,19.8 79.7,21.35 v79.3,21.75
  Bottom 0.2: LCD1.11 84.74,28.35 81.97,28.35 81.45,27.83 81.45,23.1 80.1,21.75 v79.3,21.75
LCD_D5  (via drill 0.3 pad 0.6)
  Top 0.2: v79.85,22.35 80.1,22.1 80.1,20.65 81.42,19.32 U4.10
  Bottom 0.2: LCD1.12 86.88,28.75 81.8,28.75 81.05,28 81.05,23.3 80.1,22.35 v79.85,22.35
LCD_D6  (via drill 0.3 pad 0.6)
  Top 0.2: v79.3,22.95 80.1,22.95 80.5,22.55 80.5,21 80.91,20.59 U4.11
  Bottom 0.2: LCD1.13 84.78,30.85 81.92,30.85 80.65,29.58 80.65,23.5 80.1,22.95 v79.3,22.95
LCD_D7  (via drill 0.3 pad 0.6)
  Top 0.2: v79.85,23.55 80.2,23.55 80.9,22.85 80.9,22.1 81.14,21.86 U4.12
  Bottom 0.2: LCD1.14 86.92,31.25 81.75,31.25 80.25,29.75 80.25,23.95 v79.85,23.55
LCD_E  (via drill 0.3 pad 0.6)
  Top 0.2: U4.6 75.41,20.59 77.1,22.28 v77.1,22.5
  Bottom 0.2: v77.1,22.5 77.1,21.47 77.56,21.01 85.94,21.01 85.95,21 87.01,21 LCD1.6
LCD_RS  (via drill 0.3 pad 0.6)
  Top 0.2: U4.4 75.27,23.14 v75.9,22.5
  Bottom 0.2: LCD1.4 86.72,18.75 78.68,18.75 75.9,21.53 v75.9,22.5
LCD_RW  (via drill 0.3 pad 0.6)
  Top 0.2: U4.5 76.11,21.86 76.5,22.25 v76.5,23.05
  Bottom 0.2: v76.5,23.05 76.5,21.5 78.04,19.96 LCD1.5
MEGA_MISO  (via drill 0.3 pad 0.6)
  Top 0.2: v62.7,20.15 62.3,19.75 62.3,18.34 U5.16 | CN11.1 5.32,32.7 10.25,32.7 10.65,33.1 10.65,41.83 11.92,43.1 47.2,43.1 H5.3
  Bottom 0.2: H5.3 51.75,38.55 59.03,38.55 60,37.58 60,21.75 61.6,20.15 v62.7,20.15
MEGA_MOSI  (via drill 0.3 pad 0.6)
  Top 0.2: 61.9,19.97 | U5.15 61.9,19.07 61.9,19.97 | v63.25,20.75 62.25,20.75 61.9,20.4 61.9,19.97 | CN11.4 7.07,32.05 v9.75,32.05 | v9.75,33.35 10.25,33.85 10.25,42 11.75,43.5 49.34,43.5 H5.4
  Bottom 0.2: H5.4 53.89,38.95 59.2,38.95 60.4,37.75 60.4,22.1 61.75,20.75 v63.25,20.75
  Bottom 0.6: v9.75,32.05 v9.75,33.35
MEGA_RST  (via drill 0.3 pad 0.6)
  Top 0.2: CN11.5 5.19,27.5 6.75,27.5 11.45,32.2 11.45,41.5 12.25,42.3 42.92,42.3 H5.1 | U5.29 66.25,26.82 v66.25,27.75 C23.1 | v59,33 v66.25,33
  Top 0.4: C23.1 R33.1
  Bottom 0.2: H5.1 47.47,37.75 58.7,37.75 59.2,37.25 59.2,33.2 v59,33 | v66.25,33 v66.25,27.75
MEGA_SCK  (via drill 0.3 pad 0.6)
  Top 0.2: U5.17 63,18.04 63,19.3 v63.25,19.55 | CN11.3 5.23,30.25 8.9,30.25 11.05,32.4 11.05,41.67 12.08,42.7 45.06,42.7 H5.2
  Top 0.4: R8.1 v40.5,41
  Bottom 0.2: v63.25,19.55 61.45,19.55 59.6,21.4 59.6,37.42 58.87,38.15 49.61,38.15 H5.2 46.76,42.24 46.25,42.75 41.5,42.75 40.5,41.75 v40.5,41
N$1
  Top 1: U1.1 20.55,3.8 21.75,5 C6.+ 24.1,3.15 24.75,2.5 33,2.5 33.85,3.35 D1.C
N$2  (via drill 0.3 pad 0.6)
  Top 0.4: U3.4 42.63,23.14 v42.65,23.15 | v43,20 C10.1
  Bottom 0.4: v42.65,23.15 43,22.8 v43,20
N$3
  Top 0.4: LED1.A R8.2
N$4
  Top 0.4: LED2.A R9.2
N$7
  Top 0.4: POT1.2 82.59,14.5 LCD1.3
N$8
  Top 0.4: CN1.1 8.55,14.55 11,17 15,17 16,16 F1.1
N$34
  Top 0.4: U5.20 66.18,18.25 67.5,18.25 68.5,17.25 C28.1
N$38
  Top 0.4: C30.1 48.95,16.2 50.42,17.67 XT2.1 52,23.25 53.25,24.5 56.54,24.5 U5.8
N$39
  Top 0.4: C9.1 40.75,16.25 | 40.75,16.25 40.75,16.75 40.25,17.25 40.25,17.75 40.55,18.05 U3.8 | XT1.1 37.83,17.67 39.25,16.25 40.75,16.25
N$40
  Top 0.4: U3.7 40.67,19.32 40.25,19.75 40.25,27.5 40.75,28 C8.1 39.3,28.8 37.83,27.33 XT1.2
N$44
  Top 0.4: C29.1 48.95,28.8 50.42,27.33 XT2.2 54.85,27.33 U5.7
N$88  (via drill 0.3 pad 0.6)
  Top 0.2: v8.75,13.55 8.55,13.35 8.1,13.35 7.55,13.9 CN1.2 | R39.1 45.25,31 45,30.75 v44.25,30.75
  Bottom 0.2: v44.25,30.75 44.05,30.55 42.88,30.55 29.73,17.4 11.15,17.4 10,16.25 10,13.75 9.6,13.35 8.95,13.35 v8.75,13.55
N$89  (via drill 0.3 pad 0.6)
  Top 0.2: R40.1 43,30.25 43.25,30 44.2,30 v44.25,29.95 | v8.75,12.75 8.55,12.95 7.93,12.95 7.63,13.25 CN1.3
  Bottom 0.2: v44.25,29.95 44.05,30.15 43.05,30.15 29.9,17 11.32,17 10.4,16.08 10.4,13.58 9.77,12.95 8.95,12.95 v8.75,12.75
N$90
  Top 0.2: U3.6 43.59,20.59 44.45,21.45 44.45,28 R39.2
N$91
  Top 0.2: R40.2 44.05,27.75 44.05,22.3 43.62,21.86 U3.5

### Text on the board
tPlace: KEYPAD I2C ADR: 0x20 | emrelabs.com - PanelDuino-2x8 | LED (13) | LCD2x8 I2C ADR: 0x21 | ICSP | RST | D13 | D12 | D11 | D10 | D9 | D8 | D7 | D6 | D5 | D4 | D3 | D2 | D1 | D0 | Pro-Mini Compatible (5V-16MHz) | TX | RX | Design In / Turkey | RAW IN 8V-18V | LCD CONTRAST | RAW | +5V | +5V | +5V | GND | GND | GND | A0 | A1 | A2 | A3 | A4 | A5 | A6 | A7 | Note: A4 and A5 pins are used as I2C !
bPlace: BT1 | BT5 | BT2 | BT4 | BT3 | emrelabs.com | PanelDuino-2x8LCD